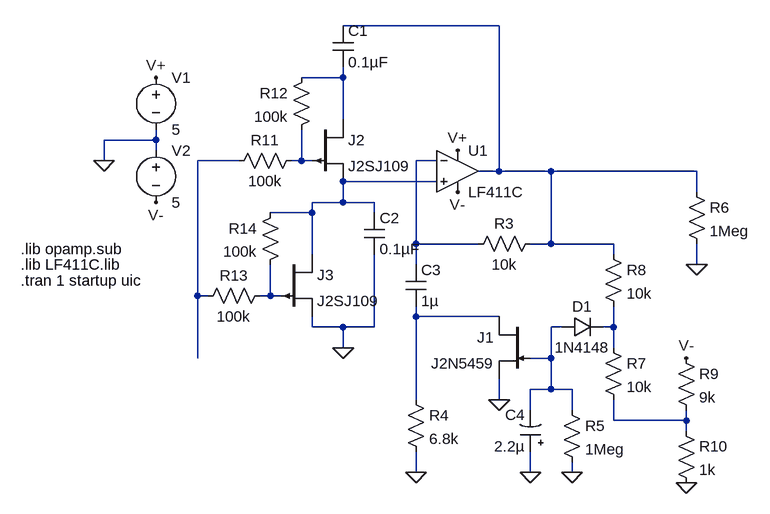
[diagram p0: schematic WeinBridge.asc]
WeinBridge.asc, the LTspice schematic file:
Version 4
SHEET 1 880 680
WIRE 288 -48 48 -48
WIRE 48 32 48 16
WIRE 48 32 -16 32
WIRE 48 96 48 32
WIRE -240 128 -240 112
WIRE -240 128 -320 128
WIRE -240 144 -240 128
WIRE -320 160 -320 128
WIRE -112 160 -176 160
WIRE -16 160 -16 112
WIRE -16 160 -32 160
WIRE 0 160 -16 160
WIRE 192 160 160 160
WIRE 288 176 288 -48
WIRE 288 176 256 176
WIRE 368 176 288 176
WIRE 592 176 368 176
WIRE 192 192 48 192
WIRE 592 208 592 176
WIRE 48 224 48 192
WIRE 48 224 0 224
WIRE 96 224 48 224
WIRE 0 240 0 224
WIRE 0 240 -64 240
WIRE 96 240 96 224
WIRE 160 288 160 160
WIRE 256 288 160 288
WIRE 368 288 368 176
WIRE 368 288 336 288
WIRE 464 288 368 288
WIRE 0 304 0 240
WIRE 464 304 464 288
WIRE 160 320 160 288
WIRE 592 320 592 288
WIRE -176 368 -176 160
WIRE -160 368 -176 368
WIRE -64 368 -64 320
WIRE -64 368 -80 368
WIRE -48 368 -64 368
WIRE 160 400 160 384
WIRE 288 400 160 400
WIRE 0 416 0 400
WIRE 48 416 0 416
WIRE 96 416 96 304
WIRE 96 416 48 416
WIRE 384 416 368 416
WIRE 464 416 464 384
WIRE 464 416 448 416
WIRE 48 448 48 416
WIRE 464 448 464 416
WIRE -176 464 -176 368
WIRE 368 464 368 416
WIRE 368 464 336 464
WIRE 368 512 368 464
WIRE 368 512 336 512
WIRE 400 512 368 512
WIRE 160 528 160 400
WIRE 288 528 288 496
WIRE 336 544 336 512
WIRE 400 544 400 512
WIRE 464 560 464 528
WIRE 576 560 576 544
WIRE 576 560 464 560
WIRE 576 576 576 560
WIRE 160 640 160 608
WIRE 336 640 336 608
WIRE 400 640 400 624
FLAG 336 640 0
FLAG 400 640 0
FLAG 160 640 0
FLAG 288 528 0
FLAG -320 160 0
FLAG -240 32 V+
FLAG 224 144 V+
FLAG -240 224 V-
FLAG 224 208 V-
FLAG 592 320 0
FLAG 576 464 V-
FLAG 576 656 0
FLAG 48 448 0
SYMBOL Opamps\\opamp2 224 112 R0
SYMATTR InstName U1
SYMATTR Value LF411C
SYMBOL cap 80 240 R0
SYMATTR InstName C2
SYMATTR Value 0.1µF
SYMBOL res 352 272 R90
WINDOW 0 0 56 VBottom 2
WINDOW 3 32 56 VTop 2
SYMATTR InstName R3
SYMATTR Value 10k
SYMBOL cap 144 320 R0
SYMATTR InstName C3
SYMATTR Value 1µ
SYMBOL res 144 512 R0
SYMATTR InstName R4
SYMATTR Value 6.8k
SYMBOL njf 336 400 M0
SYMATTR InstName J1
SYMATTR Value J2N5459
SYMBOL diode 384 432 R270
WINDOW 0 32 32 VTop 2
WINDOW 3 0 32 VBottom 2
SYMATTR InstName D1
SYMATTR Value 1N4148
SYMBOL res 384 528 R0
SYMATTR InstName R5
SYMATTR Value 1Meg
SYMBOL polcap 352 608 R180
WINDOW 0 24 57 Left 2
WINDOW 3 24 8 Left 2
SYMATTR InstName C4
SYMATTR Value 2.2µ
SYMBOL voltage -240 16 R0
WINDOW 123 0 0 Left 0
WINDOW 39 0 0 Left 0
SYMATTR InstName V1
SYMATTR Value 5
SYMBOL voltage -240 128 R0
WINDOW 123 0 0 Left 0
WINDOW 39 0 0 Left 0
SYMATTR InstName V2
SYMATTR Value 5
SYMBOL res 576 192 R0
SYMATTR InstName R6
SYMATTR Value 1Meg
SYMBOL res 448 432 R0
SYMATTR InstName R7
SYMATTR Value 10k
SYMBOL res 448 288 R0
SYMATTR InstName R8
SYMATTR Value 10k
SYMBOL res 560 448 R0
SYMATTR InstName R9
SYMATTR Value 9k
SYMBOL res 560 560 R0
SYMATTR InstName R10
SYMATTR Value 1k
SYMBOL res -16 144 R90
WINDOW 0 0 56 VBottom 2
WINDOW 3 32 56 VTop 2
SYMATTR InstName R11
SYMATTR Value 100k
SYMBOL res 0 16 M0
SYMATTR InstName R12
SYMATTR Value 100k
SYMBOL pjf 0 96 R0
SYMATTR InstName J2
SYMATTR Value J2SJ109
SYMBOL res -64 352 R90
WINDOW 0 0 56 VBottom 2
WINDOW 3 32 56 VTop 2
SYMATTR InstName R13
SYMATTR Value 100k
SYMBOL res -48 224 M0
SYMATTR InstName R14
SYMATTR Value 100k
SYMBOL pjf -48 304 R0
SYMATTR InstName J3
SYMATTR Value J2SJ109
SYMBOL cap 32 -48 R0
SYMATTR InstName C1
SYMATTR Value 0.1µF
TEXT -448 320 Left 2 !.lib LF411C.lib
TEXT -448 344 Left 2 !.tran 1 startup uic
TEXT -448 296 Left 2 !.lib opamp.sub

The netlist it stands for:
* WeinBridge.asc
XU1 N006 N005 V+ V- N001 LF411C  ; pins In+ In- V+ V- OUT
C2 N006 0 0.1µF
R3 N001 N005 10k
C3 N005 N008 1µ
R4 N008 0 6.8k
J1 N008 N009 0 J2N5459
D1 N009 N010 1N4148
R5 N009 0 1Meg
C4 0 N009 2.2µ
V1 V+ 0 5
V2 0 V- 5
R6 N001 0 1Meg
R7 N010 N011 10k
R8 N001 N010 10k
R9 V- N011 9k
R10 N011 0 1k
R11 N004 N003 100k
R12 N002 N004 100k
J2 N002 N004 N006 J2SJ109
R13 N007 N003 100k
R14 N006 N007 100k
J3 N006 N007 0 J2SJ109
C1 N001 N002 0.1µF
.model D D
.lib standard.dio
.model NJF NJF
.model PJF PJF
.lib standard.jft
.lib LF411C.lib
.tran 1 startup uic
.lib opamp.sub
.backanno
.end